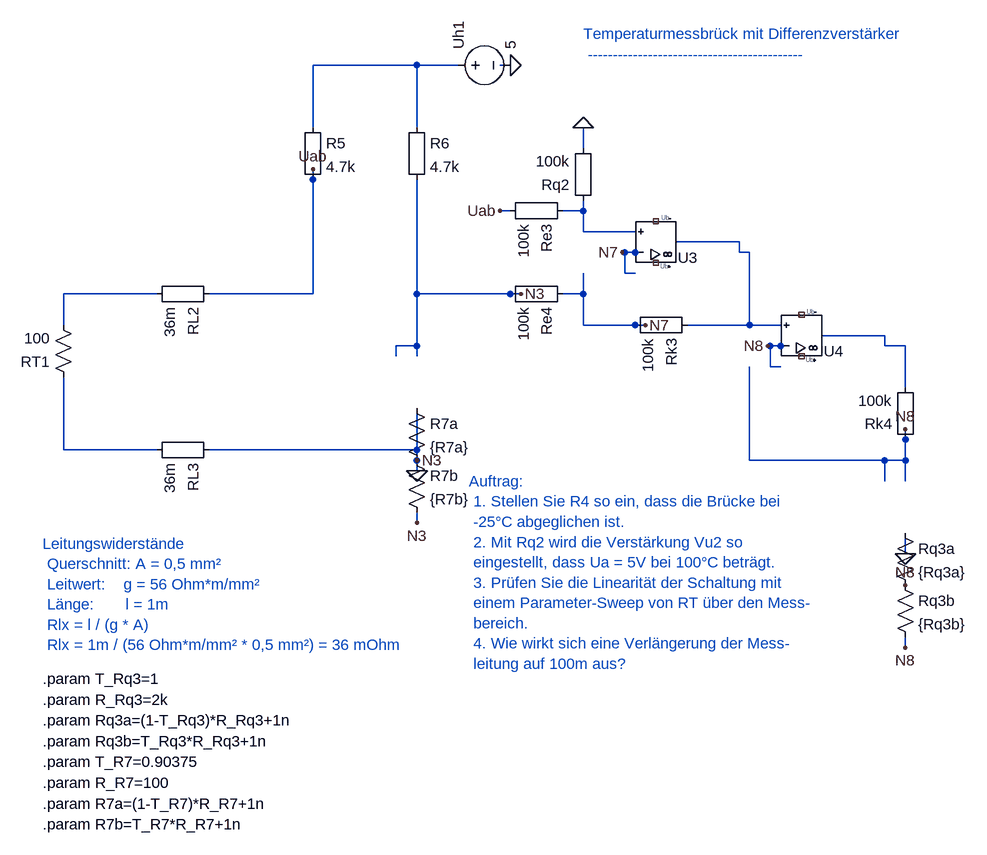
[diagram p0: schematic 1_3_2_PT100-Sensor_mit_Brueckenschaltung.asc]
1_3_2_PT100-Sensor_mit_Brueckenschaltung.asc, the LTspice schematic file:
Version 4
SHEET 1 880 680
WIRE 976 400 960 400
WIRE 960 400 960 432
WIRE 960 432 976 432
WIRE 1040 384 1136 384
WIRE 1136 384 1136 400
WIRE 784 112 768 112
WIRE 1200 544 1184 544
WIRE 1184 544 1184 576
WIRE 1184 576 1200 576
WIRE 1264 528 1360 528
WIRE 1360 528 1360 544
WIRE 480 288 480 336
WIRE 704 112 640 112
WIRE 640 112 480 112
WIRE 480 112 480 208
WIRE 640 208 640 112
WIRE 640 736 640 704
WIRE 480 336 480 464
WIRE 480 464 320 464
WIRE 896 208 896 240
WIRE 1056 512 1152 512
WIRE 640 288 640 464
WIRE 976 512 896 512
WIRE 896 512 896 464
WIRE 864 336 896 336
WIRE 896 336 896 368
WIRE 896 368 976 368
WIRE 896 320 896 336
WIRE 896 464 896 432
WIRE 864 464 896 464
WIRE 1392 752 1392 720
WIRE 1392 608 1392 544
WIRE 1392 544 1360 544
WIRE 1152 512 1152 400
WIRE 1152 400 1136 400
WIRE 1200 512 1152 512
WIRE 1392 720 1392 688
WIRE 1152 576 1152 720
WIRE 1152 720 1360 720
WIRE 1360 720 1392 720
WIRE 1360 752 1360 720
WIRE 1392 864 1392 832
WIRE 640 464 784 464
WIRE 640 560 640 544
WIRE 640 544 640 464
WIRE 608 560 608 544
WIRE 608 544 640 544
WIRE 640 704 320 704
WIRE 640 640 640 704
WIRE 240 464 96 464
WIRE 96 464 96 512
WIRE 96 592 96 704
WIRE 96 704 240 704
WIRE 640 800 640 816
WIRE 784 464 800 464
WIRE 976 512 992 512
WIRE 976 400 956 400
WIRE 1200 544 1180 544
WIRE 1392 688 1392 672
WIRE 1392 992 1392 1008
WIRE 480 288 480 272
WIRE 784 336 768 336
FLAG 784 112 0
FLAG 640 736 0
FLAG 896 208 0
FLAG 1392 864 0
FLAG 640 736 0
FLAG 784 112 0
FLAG 896 208 0
FLAG 1392 864 0
FLAG 640 816 N3
FLAG 800 464 N3
FLAG 640 720 N3
FLAG 992 512 N7
FLAG 956 400 N7
FLAG 1180 544 N8
FLAG 1392 672 N8
FLAG 1392 1008 N8
FLAG 1392 912 N8
FLAG 480 272 Uab
FLAG 768 336 Uab
SYMBOL UniversalOpAmp2 1008 384 M180
SYMATTR InstName U3
SYMATTR Value UniversalOpAmp2
SYMBOL res 112 608 R180
SYMATTR InstName RT1
SYMATTR Value 100
SYMBOL Misc\EuropeanResistor 336 448 R90
SYMATTR InstName RL2
SYMATTR Value 36m
SYMBOL Misc\EuropeanResistor 336 688 R90
SYMATTR InstName RL3
SYMATTR Value 36m
SYMBOL Misc\EuropeanResistor 880 320 R90
SYMATTR InstName Re3
SYMATTR Value 100k
SYMBOL voltage 688 112 R270
SYMATTR InstName Uh1
SYMATTR Value 5
SYMBOL Misc\EuropeanResistor 464 192 R0
SYMATTR InstName R5
SYMATTR Value 4.7k
SYMBOL Misc\EuropeanResistor 624 192 R0
SYMATTR InstName R6
SYMATTR Value 4.7k
SYMBOL Misc\EuropeanResistor 912 336 R180
SYMATTR InstName Rq2
SYMATTR Value 100k
SYMBOL Misc\EuropeanResistor 1072 496 R90
SYMATTR InstName Rk3
SYMATTR Value 100k
SYMBOL Misc\EuropeanResistor 880 448 R90
SYMATTR InstName Re4
SYMATTR Value 100k
SYMBOL UniversalOpAmp2 1232 528 M180
SYMATTR InstName U4
SYMATTR Value UniversalOpAmp2
SYMBOL Misc\EuropeanResistor 1408 704 R180
SYMATTR InstName Rk4
SYMATTR Value 100k
SYMBOL res 1376 816 R0
SYMATTR InstName Rq3a
SYMATTR Value {Rq3a}
SYMBOL res 1376 896 R0
SYMATTR InstName Rq3b
SYMATTR Value {Rq3b}
SYMBOL res 624 624 R0
SYMATTR InstName R7a
SYMATTR Value {R7a}
SYMBOL res 624 704 R0
SYMATTR InstName R7b
SYMATTR Value {R7b}
TEXT 64 1056 Left 2 !.param T_Rq3=1
TEXT 64 1088 Left 2 !.param R_Rq3=2k
TEXT 64 1120 Left 2 !.param Rq3a=(1-T_Rq3)*R_Rq3+1n
TEXT 64 1152 Left 2 !.param Rq3b=T_Rq3*R_Rq3+1n
TEXT 64 1184 Left 2 !.param T_R7=0.90375
TEXT 64 1216 Left 2 !.param R_R7=100
TEXT 64 1248 Left 2 !.param R7a=(1-T_R7)*R_R7+1n
TEXT 64 1280 Left 2 !.param R7b=T_R7*R_R7+1n
TEXT 64 848 Left 2 ;Leitungswiderstände \n Querschnitt: A = 0,5 mm² \n Leitwert:    g = 56 Ohm*m/mm² \n Länge:       l = 1m \n Rlx = l / (g * A) \n Rlx = 1m / (56 Ohm*m/mm² * 0,5 mm²) = 36 mOhm
TEXT 720 752 Left 2 ;Auftrag: \n 1. Stellen Sie R4 so ein, dass die Brücke bei \n -25°C abgeglichen ist. \n 2. Mit Rq2 wird die Verstärkung Vu2 so \n eingestellt, dass Ua = 5V bei 100°C beträgt. \n 3. Prüfen Sie die Linearität der Schaltung mit \n einem Parameter-Sweep von RT über den Mess- \n bereich. \n 4. Wie wirkt sich eine Verlängerung der Mess- \n leitung auf 100m aus?
TEXT 896 64 Left 2 ;Temperaturmessbrück mit Differenzverstärker \n -------------------------------------------

The netlist it stands for:
* 1_3_2_PT100-Sensor_mit_Brueckenschaltung.asc
XU3 N004 N7 NC_01 NC_02 N001 level2 UniversalOpAmp2 Avol=1Meg GBW=10Meg Slew=10Meg Ilimit=25m Rail=0 Vos=0 En=0 Enk=0 In=0 Ink=0 Rin=500Meg  ; pins In+ In- V+ V- OUT
RT1 N006 N005 100
RL2 Uab N005 36m
RL3 0 N006 36m
Re3 N004 Uab 100k
V§Uh1 N003 0 5
R5 N003 Uab 4.7k
R6 N003 0 4.7k
Rq2 N004 0 100k
Rk3 N001 N7 100k
Re4 N7 0 100k
XU4 N001 N8 NC_03 NC_04 N002 level2 UniversalOpAmp2 Avol=1Meg GBW=10Meg Slew=10Meg Ilimit=25m Rail=0 Vos=0 En=0 Enk=0 In=0 Ink=0 Rin=500Meg  ; pins In+ In- V+ V- OUT
Rk4 N8 N002 100k
Rq3a 0 N8 {Rq3a}
Rq3b N8 N8 {Rq3b}
R7a 0 0 {R7a}
R7b 0 0 {R7b}
.param T_Rq3=1
.param R_Rq3=2k
.param Rq3a=(1-T_Rq3)*R_Rq3+1n
.param Rq3b=T_Rq3*R_Rq3+1n
.param T_R7=0.90375
.param R_R7=100
.param R7a=(1-T_R7)*R_R7+1n
.param R7b=T_R7*R_R7+1n
* Leitungswiderstände
*  Querschnitt: A = 0,5 mm²
*  Leitwert:    g = 56 Ohm*m/mm²
*  Länge:       l = 1m
*  Rlx = l / (g * A)
*  Rlx = 1m / (56 Ohm*m/mm² * 0,5 mm²) = 36 mOhm
* Auftrag:
*  1. Stellen Sie R4 so ein, dass die Brücke bei
*  -25°C abgeglichen ist.
*  2. Mit Rq2 wird die Verstärkung Vu2 so
*  eingestellt, dass Ua = 5V bei 100°C beträgt.
*  3. Prüfen Sie die Linearität der Schaltung mit
*  einem Parameter-Sweep von RT über den Mess-
*  bereich.
*  4. Wie wirkt sich eine Verlängerung der Mess-
*  leitung auf 100m aus?
* Temperaturmessbrück mit Differenzverstärker
*  -------------------------------------------
.lib UniversalOpAmp2.lib
.backanno
.end